# EAGLE design uC_mini_v2 (EAGLE 8.7.1)
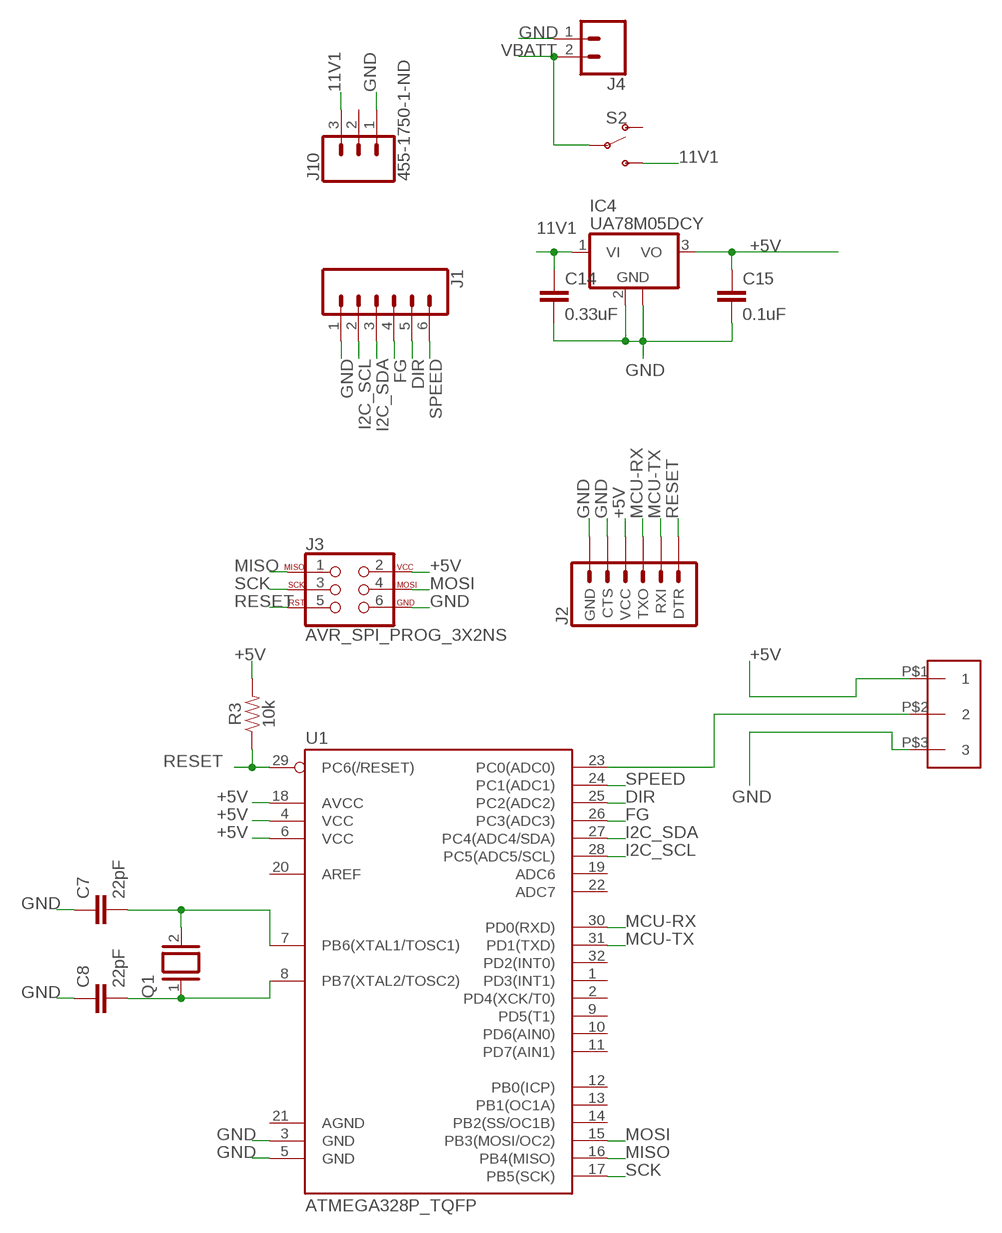
[diagram p0: schematic, sheet 1]

## Parts
C7  22pF  2.2UF-1206-50V-10%  [1206]
C8  22pF  2.2UF-1206-50V-10%  [1206]
C14  0.33uF  1.0UF-1206-50V-10%  [1206]
C15  0.1uF  1.0UF-1206-50V-10%  [1206]
IC4  UA78M05DCY  [SOT223]
J1  CONN_06LOCK  [1X06_LOCK]
J2  6_PIN_SERIAL_TARGET  [1X06]
J3  AVR_SPI_PROG_3X2NS  [2X3-NS]
J4  CONN_02LOCK  [1X02_LOCK]
J10  455-1750-1-ND  CONN_03  [1X03]
Q1  XTAL/S  [QS]
R3  10k  RESISTOR1206  [1206]
S2  SWITCH-SPDT-PTH-11.6X4.0MM  [SWITCH_SPDT_PTH_11.6X4.0MM]
U1  ATMEGA328P_TQFP  [TQFP32-08]
U$3  CONN_03_SMD_SMALL  [CONN_03_SMD_SMALL]

## Nets
11V1: C14.1 IC4.1(VI) J10.3 S2.3(S)
+5V: C15.1 IC4.3(VO) J2.4(VCC) J3.2 R3.2 U1.4(VCC) U1.6(VCC) U1.18(AVCC) U$3.P$1
DIR: J1.5 U1.25(PC2(ADC2))
FG: J1.4 U1.26(PC3(ADC3))
GND: C7.1 C8.1 C14.2 C15.2 IC4.2(GND) IC4.4(GND) J1.1 J2.5(CTS) J2.6(GND) J3.6 J4.1 J10.1 U1.3(GND) U1.5(GND) U$3.P$3
I2C_SCL: J1.2 U1.28(PC5(ADC5/SCL))
I2C_SDA: J1.3 U1.27(PC4(ADC4/SDA))
MCU-RX: J2.3(TXO) U1.30(PD0(RXD))
MCU-TX: J2.2(RXI) U1.31(PD1(TXD))
MISO: J3.1 U1.16(PB4(MISO))
MOSI: J3.4 U1.15(PB3(MOSI/OC2))
N$8: C7.2 Q1.2 U1.7(PB6(XTAL1/TOSC1))
N$10: C8.2 Q1.1 U1.8(PB7(XTAL2/TOSC2))
N$14: U1.23(PC0(ADC0)) U$3.P$2
RESET: J2.1(DTR) J3.5 R3.1 U1.29(PC6(/RESET))
SCK: J3.3 U1.17(PB5(SCK))
SPEED: J1.6 U1.24(PC1(ADC1))
VBATT: J4.2 S2.2(P)
Unconnected: J10.2 S2.1(O) U1.1(PD3(INT1)) U1.2(PD4(XCK/T0)) U1.9(PD5(T1)) U1.10(PD6(AIN0)) U1.11(PD7(AIN1)) U1.12(PB0(ICP)) U1.13(PB1(OC1A)) U1.14(PB2(SS/OC1B)) U1.19(ADC6) U1.20(AREF) U1.21(AGND) U1.22(ADC7) U1.32(PD2(INT0))

## Library data of the parts
C7 C8 = SparkFun-Capacitors:2.2UF: 2.2µF ceramic capacitors A capacitor is a passive two-terminal electrical component used to store electrical energy temporarily in an electric field.; PROD_ID: CAP-10009; VALUE: 2.2uF
C14 C15 = SparkFun-Capacitors:1.0UF: 1µF ceramic capacitors A capacitor is a passive two-terminal electrical component used to store electrical energy temporarily in an electric field.; PROD_ID: CAP-09822; VALUE: 1.0uF
IC4 = linear:UA78M*: POSITIVE-VOLTAGE REGULATORS Source: http://focus.ti.com/lit/ds/symlink/ua78m33.pdf
J1 = SparkFun-Connectors:CONN_06: Multi connection point. Often used as Generic Header-pin footprint for 0.1 inch spaced/style header connections On any of the 0.1 inch spaced packages, you can populate with these: Break Away Headers - Straight <https://www.sparkfun.com/products/116> (PRT-00116) Break Away Male Headers - Right Angle <https://www.sparkfun.com/products/553> (PRT-00553) Female Headers <https://www.sparkfun.com/products/115> (PRT-00115) Break Away Headers - Machine Pin <https://www.sparkfun.com/products/117> (PRT-00117) Break Away Female Headers - Swiss Machine Pin <https://www.sparkfun.com/products/743> (PRT-00743) Arduino Stackable Header - 6 Pin <https://www.sparkfun.com/products/9280> (PRT-09280) For SCREWTERMINALS and SPRING TERMINALS visit here: Screw Terimnals on SparkFun.com <https://www.sparkfun.com/search/results?term=Screw+Terminals> (5mm/3.5mm/2.54mm spacing) This device is also useful as a general connection point to wire up your design to another part of your project. Our various solder wires solder well into these plated through hole pads. Hook-Up Wire - Assortment (Stranded, 22 AWG) <https://www.sparkfun.com/products/11375> (PRT-11375) Hook-Up Wire - Assortment (Solid Core, 22 AWG) <https://www.sparkfun.com/products/11367> (PRT-11367) View the entire wire category on our website here <https://www.sparkfun.com/categories/141>
J2 = SparkFun-Connectors:6_PIN_SERIAL_TARGET: 6-pin header connection for use with the "FTDI BASIC" pinout - TARGET SIDE. Also known as "Arduino Serial Program Header". It is used to mate with our FTDI Basic serial programmers using the Arduino IDE. Note, this device has "TARGET" in the name. It is intended to be used on a design that contains a target micro-controller that you wish to program. The "sister" device, named "CABLE" is inteneded to be used on a design that usually lives on the end of your USB cable and prvides the converter chip (FTDI232 or FTDI231x) to commnicate serial RX/TX. You can populate with some of these: Break Away Headers - Straight <https://www.sparkfun.com/products/116> (PRT-00116) For reference (or to suit your programming needs) check out these designs: SparkFun FTDI Basic Breakout - 5V <https://www.sparkfun.com/products/9716> (DEV-09716) SparkFun FTDI Basic Breakout - 3.3V <https://www.sparkfun.com/products/9873> (DEV-09873) SparkFun FTDI SmartBasic <https://www.sparkfun.com/products/12935> (DEV-12935) SparkFun Beefy 3 - FTDI Basic Breakout <https://www.sparkfun.com/products/13746> (DEV-13746)
J3 = SparkFun-Connectors:AVR_SPI_PROG_3X2: AVR ISP 6 Pin This is the reduced ISP connector for AVR programming. Common on Arduino. This footprint will take up less PCB space and can be used with a 10-pin to 6-pin adapter such as SKU: BOB-08508 **Special note about "TEST_POINT" package. The stop mask is on the top side, so if you want your programming test points to be on the bottom of your board, make sure to place this package on the bottom side of the board. This also ensure that the orientation to program from the bottom side will be correct. SparkFun Products: SparkFun ISP Pogo Adapter <https://www.sparkfun.com/products/11591> - NS Tiny AVR Programmer <https://www.sparkfun.com/products/11801> -PTH
J4 = SparkFun-Connectors:CONN_02: Multi connection point. Often used as Generic Header-pin footprint for 0.1 inch spaced/style header connections On any of the 0.1 inch spaced packages, you can populate with these: Break Away Headers - Straight <https://www.sparkfun.com/products/116> (PRT-00116) Break Away Male Headers - Right Angle <https://www.sparkfun.com/products/553> (PRT-00553) Female Headers <https://www.sparkfun.com/products/115> (PRT-00115) Break Away Headers - Machine Pin <https://www.sparkfun.com/products/117> (PRT-00117) Break Away Female Headers - Swiss Machine Pin <https://www.sparkfun.com/products/743> (PRT-00743) For SCREWTERMINALS and SPRING TERMINALS visit here: Screw Terimnals on SparkFun.com <https://www.sparkfun.com/search/results?term=Screw+Terminals> (5mm/3.5mm/2.54mm spacing) This device is also useful as a general connection point to wire up your design to another part of your project. Our various solder wires solder well into these plated through hole pads. Hook-Up Wire - Assortment (Stranded, 22 AWG) <https://www.sparkfun.com/products/11375> (PRT-11375) Hook-Up Wire - Assortment (Solid Core, 22 AWG) <https://www.sparkfun.com/products/11367> (PRT-11367) View the entire wire category on our website here <https://www.sparkfun.com/categories/141> Special notes: Molex polarized connector foot print use with: PRT-08233 with associated crimp pins and housings. 2.54_SCREWTERM for use with PRT-10571. 3.5mm Screw Terminal footprints for PRT-08084 5mm Screw Terminal footprints for use with PRT-08432
J10 = SparkFun-Connectors:CONN_03: Multi connection point. Often used as Generic Header-pin footprint for 0.1 inch spaced/style header connections On any of the 0.1 inch spaced packages, you can populate with these: Break Away Headers - Straight <https://www.sparkfun.com/products/116> (PRT-00116) Break Away Male Headers - Right Angle <https://www.sparkfun.com/products/553> (PRT-00553) Female Headers <https://www.sparkfun.com/products/115> (PRT-00115) Break Away Headers - Machine Pin <https://www.sparkfun.com/products/117> (PRT-00117) Break Away Female Headers - Swiss Machine Pin <https://www.sparkfun.com/products/743> (PRT-00743) Stackable Header - 3 Pin (Female, 0.1") <https://www.sparkfun.com/products/13875> (PRT-13875) For SCREWTERMINALS and SPRING TERMINALS visit here: Screw Terimnals on SparkFun.com <https://www.sparkfun.com/search/results?term=Screw+Terminals> (5mm/3.5mm/2.54mm spacing) This device is also useful as a general connection point to wire up your design to another part of your project. Our various solder wires solder well into these plated through hole pads. Hook-Up Wire - Assortment (Stranded, 22 AWG) <https://www.sparkfun.com/products/11375> (PRT-11375) Hook-Up Wire - Assortment (Solid Core, 22 AWG) <https://www.sparkfun.com/products/11367> (PRT-11367) View the entire wire category on our website here <https://www.sparkfun.com/categories/141> Special notes: Molex polarized connector foot print use with SKU : PRT-08232 with associated crimp pins and housings.; PROD_ID: XXX-00000
Q1 = special:XTAL/S: CRYSTAL
R3 = SparkFun-Resistors:RESISTOR: Generic Resistor Package
S2 = SparkFun-Switches:SWITCH-SPDT: Single Pole, Double Throw (SPDT) Switch Single-pole, double-throw (SPDT) switch. Variant Overview SMD-AYZ0202 Surface Mount DPDT Switch <https://www.sparkfun.com/products/597> (COM-00597) Used on e.g. LilyPad Arduino USB - ATmega32U4 Board <https://www.sparkfun.com/products/12049> PTH-11.6X4.0MM SPDT Mini Power Switch <https://www.sparkfun.com/products/102> (COM-00102) Used on e.g. SparkFun Simon Says - Through-Hole Soldering Kit <https://www.sparkfun.com/products/10547> (KIT-10547) PTH-11.6X4.0MM-KIT KIT version of SPDT Mini Power Switch - Simplifies soldering by removing tStop of switch pins - only one side can be soldered. PTH-11.6X4.0MM-LOCK LOCK version of SPDT Mini Power Switch - Offset pins hold switch in place for easier soldering. SMD-RIGHT-ANGLE Surface Mount Right Angle Switch <https://www.sparkfun.com/products/10860> (COM-10860) Used on e.g. SparkFun ESP8266 Thing <https://www.sparkfun.com/products/13231>; PROD_ID: SWCH-08261; SF_SKU: COM-00102
U1 = SparkFun-IC-Microcontroller:ATMEGA328P_TQFP: Popular 328P in QFP Storefront component: ATmega328 - TQFP <https://www.sparkfun.com/products/13448> (COM-13448) Datasheet <http://www.sparkfun.com/datasheets/Components/SMD/ATMega328.pdf> SparkFun Products SparkFun RedBoard - Programmed with Arduino <https://www.sparkfun.com/products/12757> (DEV-12757) Arduino Pro Mini 328 - 5V/16MHz <https://www.sparkfun.com/products/11113> (DEV-11113) Arduino Pro Mini 328 - 3.3V/8MHz <https://www.sparkfun.com/products/11114> (DEV-11114) SparkFun OpenLog <https://www.sparkfun.com/products/13712> (DEV-13712) SparkFun MicroView - OLED Arduino Module <https://www.sparkfun.com/products/12923> (DEV-12923) SparkFun Digital Sandbox <https://www.sparkfun.com/products/12651> (DEV-12651) SparkFun PicoBoard <https://www.sparkfun.com/products/11888> (WIG-11888) Arduino Fio <https://www.sparkfun.com/products/10116> (DEV-10116) LilyPad Arduino 328 Main Board <https://www.sparkfun.com/products/13342> (DEV-13342) SparkFun RedStick <https://www.sparkfun.com/products/13741> (DEV-13741) LilyPad MP3 <https://www.sparkfun.com/products/11013> (DEV-11013) LilyPad Arduino SimpleSnap <https://www.sparkfun.com/products/10941> (DEV-10941) SparkFun Stepoko <https://www.sparkfun.com/products/13899> (ROB-13899) SparkFun Geiger Counter <https://www.sparkfun.com/products/11345> (SEN-11345) SparkFun EL Sequencer <https://www.sparkfun.com/products/12781> (COM-12781) Arduino Pro 328 - 5V/16MHz <https://www.sparkfun.com/products/10915> (DEV-10915) CryptoCape <https://www.sparkfun.com/products/12773> (DEV-12773) SparkFun IR Thermometer Evaluation Board - MLX90614 <https://www.sparkfun.com/products/10740> (SEN-10740) SparkFun RedBot Mainboard <https://www.sparkfun.com/products/12097> (ROB-12097) Arduino Pro 328 - 3.3V/8MHz <https://www.sparkfun.com/products/10914> (DEV-10914) SparkFun Block for Intel® Edison - Arduino <https://www.sparkfun.com/products/13036> (DEV-13036) SparkFun Simon Says - Surface Mount Soldering Kit <https://www.sparkfun.com/products/10935> (KIT-10935) SparkFun 7-Segment Serial Display - Red <https://www.sparkfun.com/products/11441> (COM-11441) SparkFun 7-Segment Serial Display - White <https://www.sparkfun.com/products/11629> (COM-11629) SparkFun 7-Segment Serial Display - Yellow <https://www.sparkfun.com/products/11443> (COM-11443) SparkFun 7-Segment Serial Display - Kelly Green <https://www.sparkfun.com/products/11440> (COM-11440) SparkFun 7-Segment Serial Display - Blue <https://www.sparkfun.com/products/11442> (COM-11442) SparkFun OpenSegment Serial Display - 20mm (Blue) <https://www.sparkfun.com/products/11647> (COM-11647) SparkFun OpenSegment Serial Display - 20mm (Green) <https://www.sparkfun.com/products/11646> (COM-11646) SparkFun OpenSegment Serial Display - 20mm (White) <https://www.sparkfun.com/products/11648> (COM-11648) SparkFun OpenSegment Serial Display - 20mm (Red) <https://www.sparkfun.com/products/11644> (COM-11644) SparkFun OpenSegment Serial Display - 20mm (Yellow) <https://www.sparkfun.com/products/11645> (COM-11645) SparkFun OpenSegment Shield <https://www.sparkfun.com/products/13190> (DEV-13190); PROD_ID: IC-09069
U$3 = BLDC_DRIVER:CONN_03_SMD_SMALL

## Board
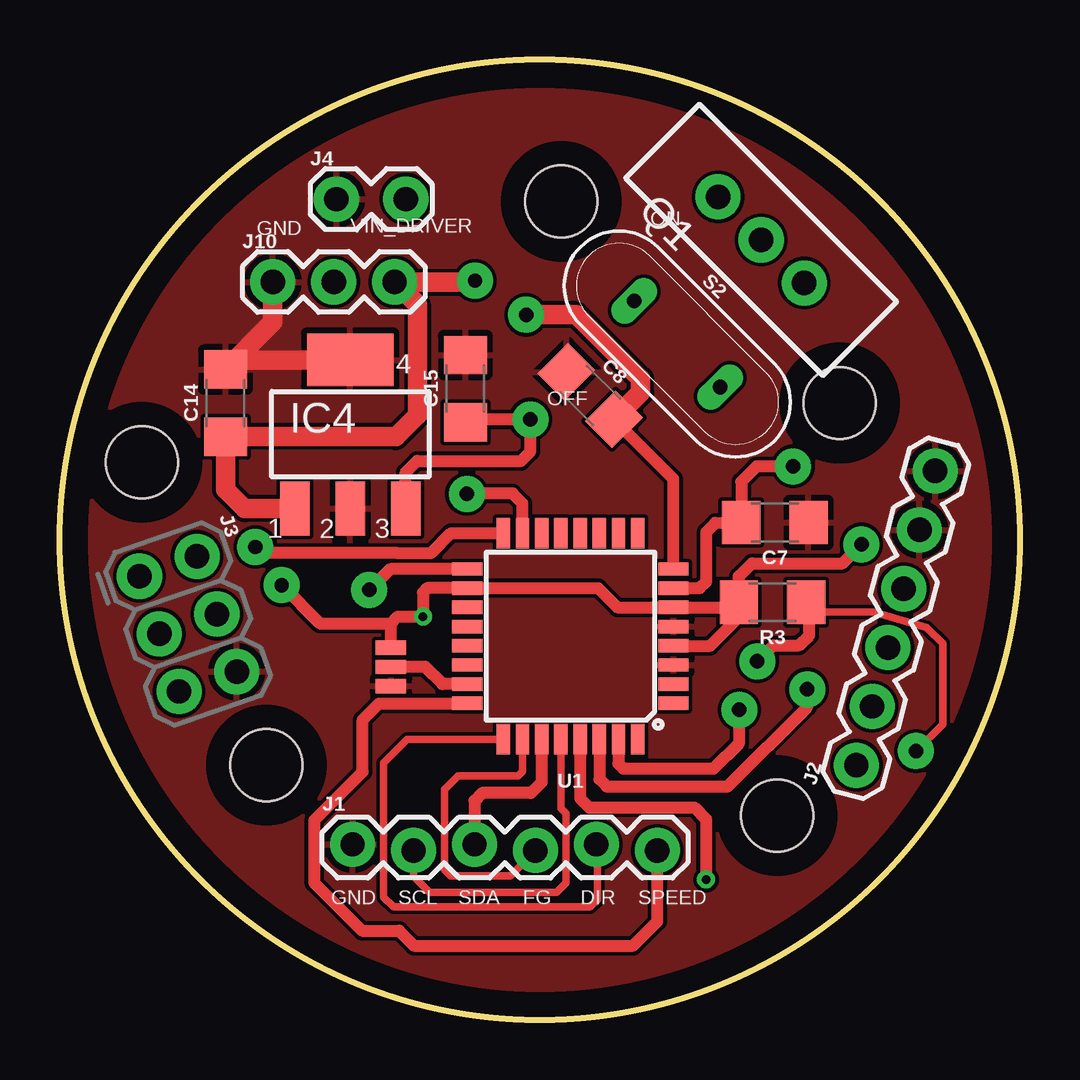
[diagram p1: board, top side]
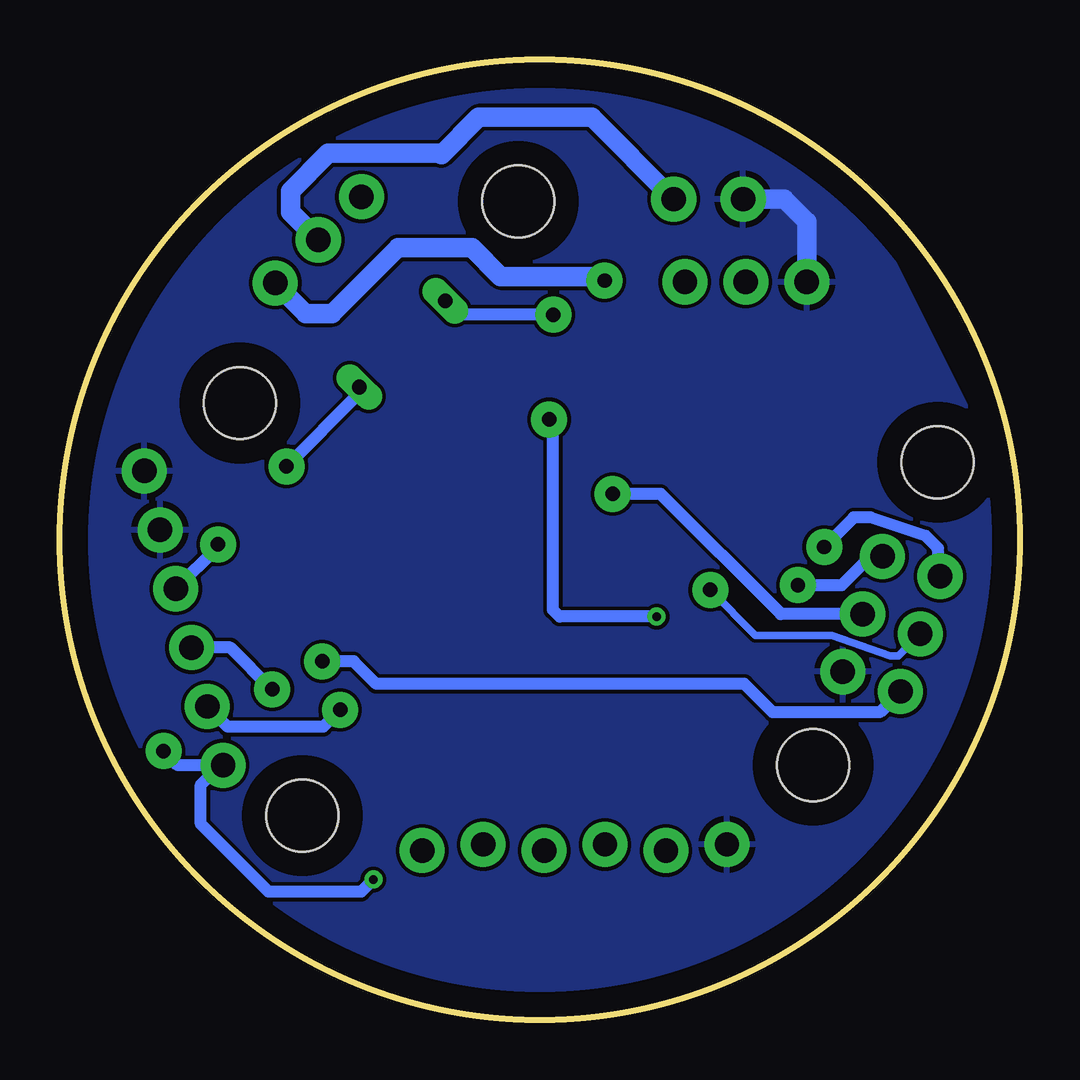
[diagram p2: board, bottom side, seen from below]

Size 40 x 40 mm. Coordinates in mm from the lower left corner, seen from the top.
Outline: circle at 20,20 radius 20
Copper layers (1*16): Top 0.035mm / dielectric 1.5mm / Bottom 0.035mm
Design rules "default": minimum track width 6mil, minimum drill 0.35mm, track to track 6mil, track to pad 6mil, pad to pad 6mil, via to via 6mil, smd to smd 6mil, copper to edge 40mil, drill to drill 6mil, minimum pad ring 10mil, minimum via ring 8mil, stop-mask expansion 4mil, vias tented up to drill 0mil, thermal gap 10mil
Holes 3 mm at 29.9,8.5 32.5,25.7 3.41,23.23 20.9,34.1 8.6,10.6

### Footprints (pad centres in the part's own frame; a part is rotated, then mirrored left to right if it is on the bottom)
1206 = smd 1.6 x 1.8: 1 -1.4,0; 2 1.4,0
SOT223 = smd 1.219 x 2.235: 1 -2.311,-3.099; 2 0,-3.099; 3 2.311,-3.099 | smd 3.6 x 2.2: 4 0,3.099
1X06_LOCK = drill 1.016 pad 1.88: 1 0,0; 2 2.54,-0.254; 3 5.08,0; 4 7.62,-0.254; 5 10.16,0; 6 12.7,-0.254
1X06 = drill 1.016 pad 1.88: 1 0,0; 2 2.54,0; 3 5.08,0; 4 7.62,0; 5 10.16,0; 6 12.7,0
2X3-NS = drill 1.016 pad 1.88: 1 -2.54,-1.27; 2 -2.54,1.27; 3 0,-1.27; 4 0,1.27; 5 2.54,-1.27; 6 2.54,1.27
1X02_LOCK = drill 1.016 pad 1.88: 1 -0.178,0; 2 2.718,0
1X03 = drill 1.016 pad 1.88: 1 0,0; 2 2.54,0; 3 5.08,0
QS = drill 0.61 long: 1 -2.54,0; 2 2.54,0
SWITCH_SPDT_PTH_11.6X4.0MM = drill 1.016 pad 1.88: 1 0,2.54; 2 0,0; 3 0,-2.54
TQFP32-08 = smd 1.27 x 0.559: 1 -4.293,2.8; 2 -4.293,2; 3 -4.293,1.2; 4 -4.293,0.4; 5 -4.293,-0.4; 6 -4.293,-1.2; 7 -4.293,-2; 8 -4.293,-2.8; 17 4.293,-2.8; 18 4.293,-2; 19 4.293,-1.2; 20 4.293,-0.4; 21 4.293,0.4; 22 4.293,1.2; 23 4.293,2; 24 4.293,2.8 | smd 0.559 x 1.27: 9 -2.8,-4.293; 10 -2,-4.293; 11 -1.2,-4.293; 12 -0.4,-4.293; 13 0.4,-4.293; 14 1.2,-4.293; 15 2,-4.293; 16 2.8,-4.293; 25 2.8,4.293; 26 2,4.293; 27 1.2,4.293; 28 0.4,4.293; 29 -0.4,4.293; 30 -1.2,4.293; 31 -2,4.293; 32 -2.8,4.293
CONN_03_SMD_SMALL = smd 0.6 x 1.27: P$1 -0.8,0; P$2 0,0; P$3 0.8,0

### Placement (x,y rotation side)
C7  29.8,20.72 180 top
C8  22.1,26.01 315 top
C14  6.9,25.7 90 top
C15  16.9,26.3 90 top
IC4  12.1,24.4 0 top
J1  12.2,7.3 0 top
J2  33.2,10.6 75 top
J3  5.34,16.49 289 top
J4  11.7,34.2 0 top
J10  8.87,30.75 0 top
Q1  25.73,28.16 315 top
R3  29.7,17.4 180 top
S2  29.23,32.5 45 top
U1  21.28,15.98 180 top
U$3  13.8,14.7 270 top

### Tracks (layer width: path | path; a pad name or v marks a point on that pad's centre or on a via)
11V1  (via drill 0.6 pad 1.5)
  Top 0.813: IC4.1 7.7,21.3 6.9,22.1 C14.1 14,24.3 14.9,25.2 14.9,29.8 J10.3 17.25,30.75 v17.3,30.8
  Bottom 0.813: S2.3 29.75,29.43 28.65,29.43 25.91,32.17 22.83,32.17 21.63,30.97 17.47,30.97 v17.3,30.8
+5V  (via drill 0.35, 0.6 pad 1.5)
  Top 0.508: 14.61,21.5 IC4.3 14.41,22.81 14.89,23.29 19.22,23.29 19.61,23.68 v19.61,25.02 17.02,25.02 C15.1 | U$3.P$1 13.8,16.52 | v9.24,18.11 10.83,16.52 13.8,16.52 | 13.8,16.52 14.08,16.8 v15.13,16.8 15.13,17.8 15.31,17.98 U1.18 22.43,17.98 23.23,17.18 U1.6 28.08,17.18 R3.2 | U1.4 27.1,15.58 28.3,16.78 R3.2 | R3.2 28.3,18.47 28.85,19.02 32.62,19.02 v33.41,19.81
  Bottom 0.508: v9.24,18.11 7.41,18.11 6.22,19.3 J3.2 | v19.61,25.02 19.45,24.86 19.45,17.08 19.17,16.8 v15.13,16.8 | J2.4 33.41,19.72 v33.41,19.81
DIR
  Top 0.254: 22.4,7.26 J1.5
  Top 0.305: 22.4,7.26 22.4,5 22.1,4.7 13.9,4.7 13.48,5.09 13.48,10.69 14.48,11.69 U1.25
FG
  Top 0.254: U1.26 19.28,11.16
  Top 0.305: U1.26 19.28,10.35 19.09,10.16 16.6,10.16 16.03,9.59 16.03,6.25 16.28,6 18.77,6 J1.4
GND
  Top 0.813: J10.1 8.87,29.07 C14.2 7.3,27.5 IC4.4
  Bottom 0.254: 12.3,7.4 J1.1
  Bottom 0.813: J4.1 9.8,34.2 8.87,33.27 J10.1
  pour Top: 6.7,34.7 10.57,37.45 15.31,39.31 21.27,39.82 26.16,38.75 31.51,36.33 35,33.21 38.21,28.46 39.7,22.36 39.42,15.93 37.61,10.85 34.95,6.75 29.88,2.61 23.78,0.42 17.97,0.14 11.08,2.23 6.61,5.35 3.68,8.75 1.07,14.44 0.1,19.28 0.33,23.29 1.86,27.99 4.56,32.51 6.66,34.65 6.66,34.69
  pour Bottom: 6.9,34.93 9.02,36.49 11.93,38.17 15,39.23 17.96,39.79 20.86,39.74 24.94,39.4 29.02,37.78 32.2,35.82 34.49,33.7 36.72,30.68 38.68,27.1 39.63,23.52 39.96,19.5 39.46,15.42 38.29,12.01 37,9.77 35.33,7.42 33.09,4.96 30.8,3.29 27.56,1.55 23.82,0.43 20.08,0.1 15.89,0.55 12.93,1.5 10.31,2.67 7.63,4.52 5.39,6.64 3.21,9.55 1.37,13.29 0.42,16.98 0.25,21.57
I2C_SCL
  Top 0.305: J1.2 14.74,5.96 15.4,5.3 20.7,5.3 21.1,5.7 21.1,8.6 20.89,8.81 20.89,11.68 U1.28
I2C_SDA
  Top 0.508: J1.3 17.28,9.12 17.6,9.44 19.63,9.44 20.08,9.89 U1.27
MCU-RX  (via drill 0.6 pad 1.5)
  Top 0.508: U1.30 22.48,10.03 22.8,9.71 27.82,9.71 31.15,13.04 v31.15,13.77
  Bottom 0.508: v31.15,13.77 32.89,15.51 J2.3
MCU-TX  (via drill 0.6 pad 1.5)
  Top 0.254: U1.31 23.28,11.26
  Top 0.508: U1.31 23.28,10.66 23.48,10.46 27.24,10.46 28.32,11.54 v28.32,12.91
  Bottom 0.508: v28.32,12.91 29.03,12.2 33,12.2 J2.2
MISO  (via drill 0.6 pad 1.5)
  Top 0.254: 14.07,19.45 14.03,19.45
  Top 0.508: v8.14,19.7 8.39,19.45 14.03,19.45 15.48,19.45 16.3,20.27 U1.16
  Bottom 0.508: J3.1 3.4,19.65 3.91,20.16 6.21,20.93 6.91,20.93 v8.14,19.7
MOSI  (via drill 0.6 pad 1.5)
  Top 0.254: U1.15 19.2,20.7
  Top 0.508: U1.15 19.28,21.52 18.87,21.93 16.98,21.93 v16.96,21.91
  Bottom 0.508: J3.4 9.95,16.9 14.96,21.91 v16.96,21.91
N$8  (via drill 0.6 pad 1.5)
  Top 0.508: v30.56,23.06 29.04,23.06 28.4,22.42 C7.2 27.32,20.7 26.94,20.32 26.94,18.26 26.66,17.98 U1.7
  Bottom 0.508: v30.56,23.06 27.53,26.09 Q1.2
N$10  (via drill 0.6 pad 1.5)
  Top 0.508: U1.8 25.57,22.54 C8.2
  Top 0.813: C8.2 24.2,26.13 24.2,26.7 21.52,29.38 v19.43,29.38
  Bottom 0.508: v19.43,29.38 23.36,29.38 Q1.1
N$14
  Top 0.508: U1.23 15.94,13.98 15.22,14.7 U$3.P$2
RESET  (via drill 0.35, 0.6 pad 1.5)
  Top 0.254: R3.1
  Top 0.305: v35.68,11.19 36.8,12.31 36.8,15.67 36.12,16.35 33.91,17 31.5,17 31.23,17.27 R3.1
  Top 0.508: v26.93,5.84 26.93,8.35 26.44,8.84 22.06,8.84 21.68,9.22 U1.29 | v29.07,14.93 29.74,15.6 30.81,15.6 31.23,16.02 31.23,17.27
  Bottom 0.254: J2.1 33.32,10.6
  Bottom 0.508: v26.93,5.84 27.44,5.33 31.31,5.33 34.13,8.15 34.13,9.79 33.32,10.6 | J2.1 35.09,10.6 v35.68,11.19 | J3.5 5.83,12.81 10.29,12.81 11.47,13.99 26.82,13.99 27.76,14.93 v29.07,14.93
SCK  (via drill 0.6 pad 1.5)
  Top 0.508: U1.17 13.78,18.78 v12.89,17.91
  Bottom 0.305: v12.89,17.91 11.01,16.01 7.83,16.01 5.38,15.16 5.06,15.16 J3.3
SPEED
  Top 0.508: J1.6 24.9,4.09 23.89,3.08 14.76,3.08 14.14,3.7 12.6,3.7 10.6,5.7 10.6,8.31 12.62,10.33 12.62,12.49 13.3,13.17 16.98,13.17 U1.24
VBATT
  Bottom 0.813: S2.2 30.39,33.66 30.39,34.54 28.82,36.11 24.15,36.11 24.1,36.06 22.55,37.61 17.83,37.61 J4.2

### Text on the board
tPlace: GND | VIN_DRIVER | ON | OFF | GND | SCL | SDA | FG | DIR | SPEED